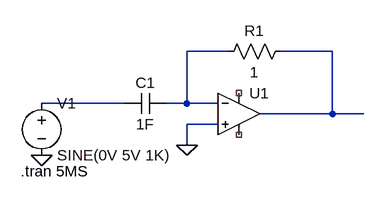
[diagram p0: schematic ideal_differentiator.asc]
ideal_differentiator.asc, the LTspice schematic file:
Version 4.1
SHEET 1 880 680
WIRE 160 48 96 48
WIRE 320 48 240 48
WIRE 0 128 -128 128
WIRE 96 128 96 48
WIRE 96 128 64 128
WIRE 144 128 96 128
WIRE 320 144 320 48
WIRE 320 144 208 144
WIRE 368 144 320 144
WIRE 144 160 96 160
WIRE 96 192 96 160
FLAG 96 192 0
FLAG -128 208 0
SYMBOL OpAmps\\UniversalOpAmp 176 144 R0
SYMATTR InstName U1
SYMBOL cap 64 112 R90
WINDOW 0 0 32 VBottom 2
WINDOW 3 32 32 VTop 2
SYMATTR InstName C1
SYMATTR Value 1F
SYMBOL res 256 32 R90
WINDOW 0 0 56 VBottom 2
WINDOW 3 32 56 VTop 2
SYMATTR InstName R1
SYMATTR Value 1
SYMBOL voltage -128 112 R0
WINDOW 123 0 0 Left 0
WINDOW 39 0 0 Left 0
SYMATTR InstName V1
SYMATTR Value SINE(0V 5V 1K)
TEXT -160 232 Left 2 !.tran 5MS

The netlist it stands for:
* ideal_differentiator.asc
X§U1 0 N001 NC_01 NC_02 N002 level1 Avol=1Meg GBW=10Meg Vos=0 En=0 Enk=0 In=0 Ink=0 Rin=500Meg  ; pins In+ In- V+ V- OUT
C1 N001 N003 1F
R1 N002 N001 1
V1 N003 0 SINE(0V 5V 1K)
.tran 5MS
.lib UniversalOpAmp1.lib
.backanno
.end